# EAGLE design Trless Modular (EAGLE 9.3.2)
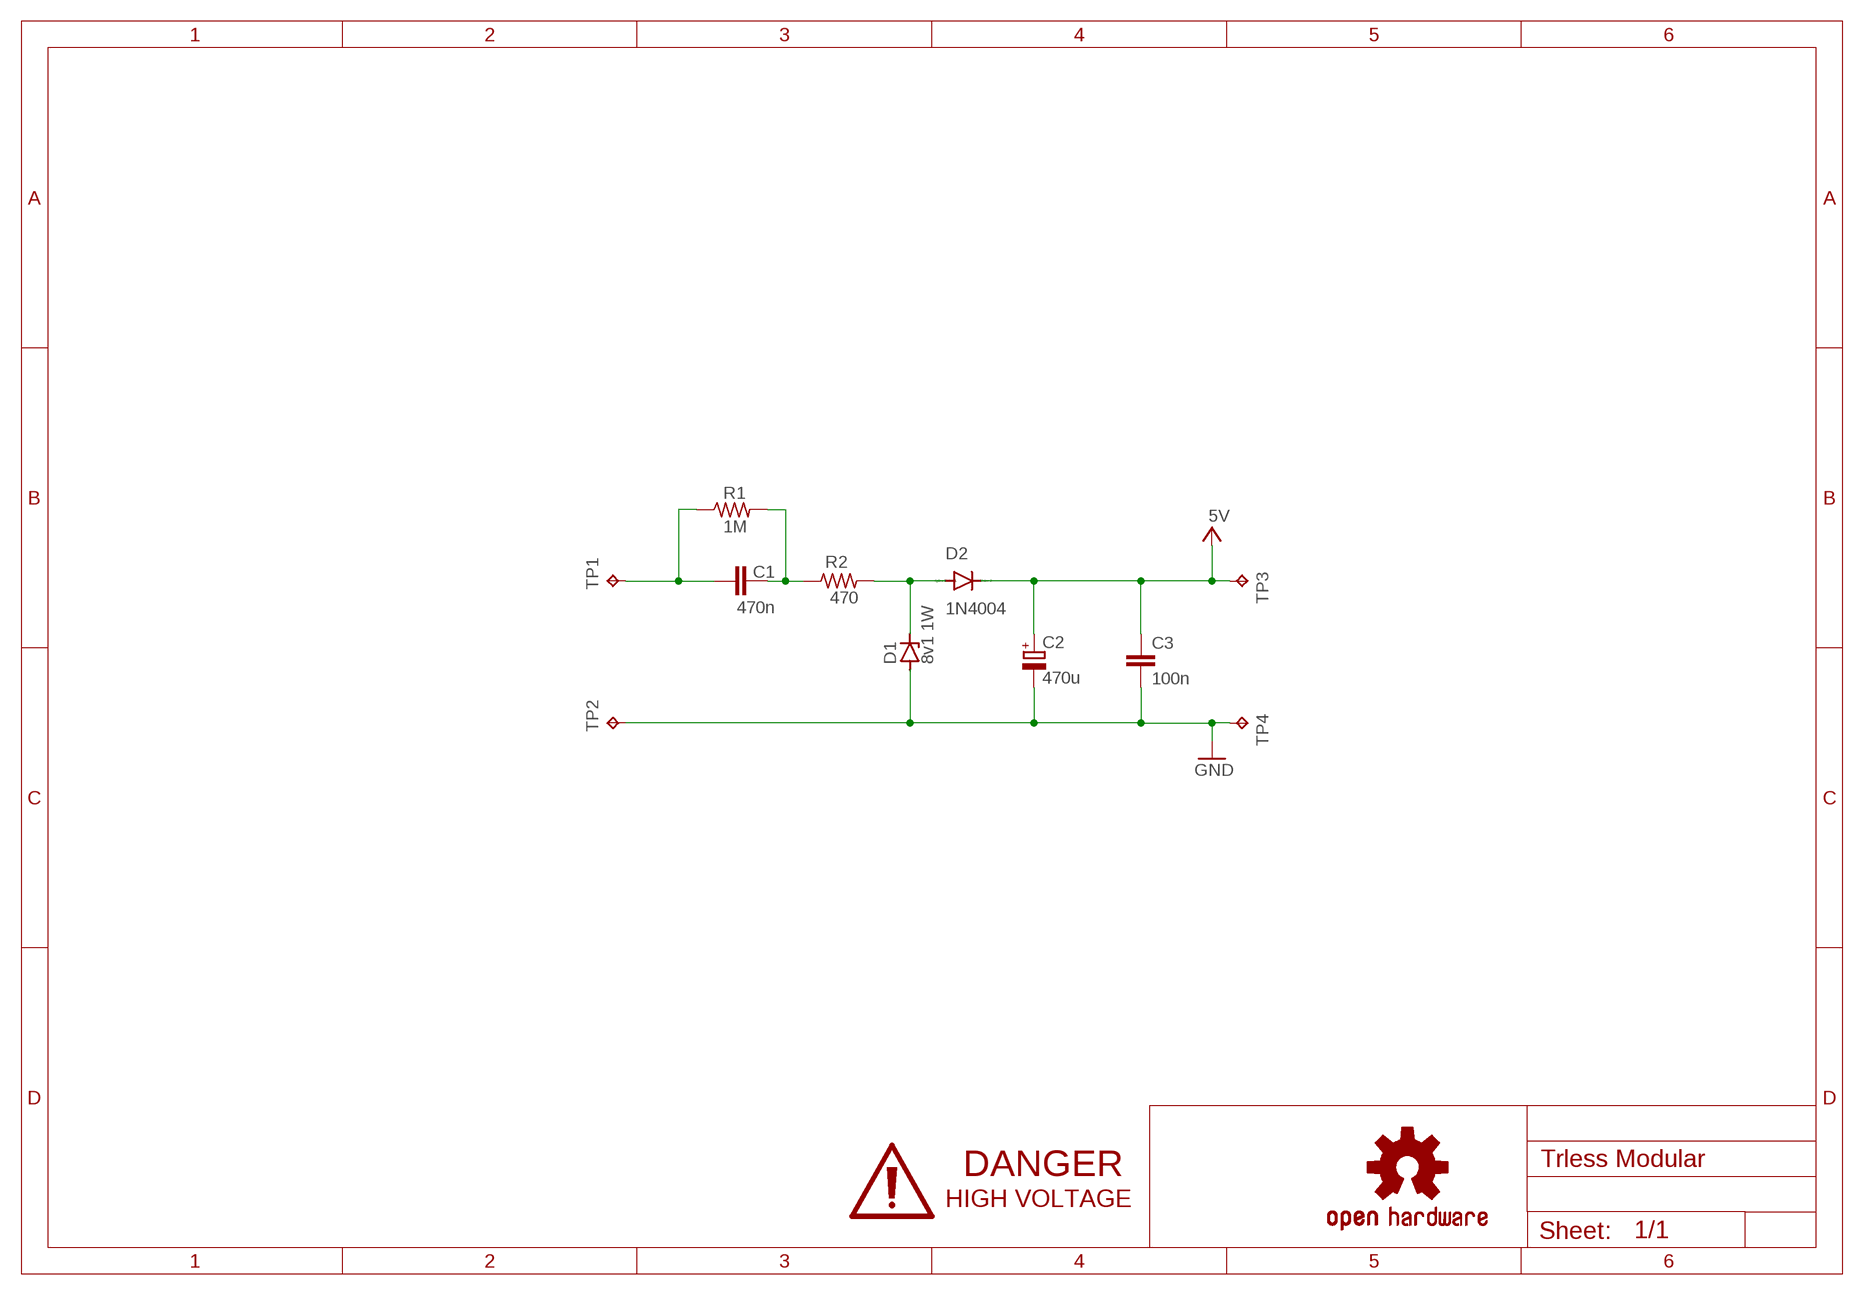
[diagram p0: schematic, sheet 1]

## Parts
C1  470n  C-EU150-054X183  [C150-054X183]
C2  470u  CPOL-EUE3.5-8  [E3,5-8]
C3  100n  C-EU050-024X044  [C050-024X044]
D1  8v1 1W  ZENER-DIODEDO35Z10  [DO35Z10]
D2  1N4004  [DO41-10]
L2  OSHW-LOGOS  [OSHW-LOGO-S]
R1  1M  R-US_0207/10  [0207/10]
R2  470  R-US_0207/10  [0207/10]
TP1  TPPAD1-17  [P1-17]
TP2  TPPAD1-17  [P1-17]
TP3  TPPAD1-17  [P1-17]
TP4  TPPAD1-17  [P1-17]

## Nets
+3V3: C2.+ C3.1 D2.C TP3.TP ; supply symbol labelled 5V
GND: C2.- C3.2 D1.A TP2.TP TP4.TP
LINE: C1.1 R1.1 TP1.TP
N$6: C1.2 R1.2 R2.1
N$7: D1.C D2.A R2.2

## Library data of the parts
C1 C3 = rcl:C-EU: CAPACITOR, European symbol; SPICEPREFIX: C
C2 = rcl:CPOL-EU: POLARIZED CAPACITOR, European symbol; SPICEPREFIX: C
D1 = diode:ZENER-DIODE: Z-Diode
D2 = diode:1N4004: DIODE general purpose rectifier, 1 A
L2 = SparkFun-Aesthetics:OSHW-LOGO: Open Source Hardware Logo This logo indicates the piece of hardware it is found on incorporates a OSHW license and/or adheres to the definition of open source hardware found here: http://freedomdefined.org/OSHW
R1 R2 = rcl:R-US_: RESISTOR, American symbol; SPICEPREFIX: R
TP1-TP4 = testpad:TP: Test pad

## Board
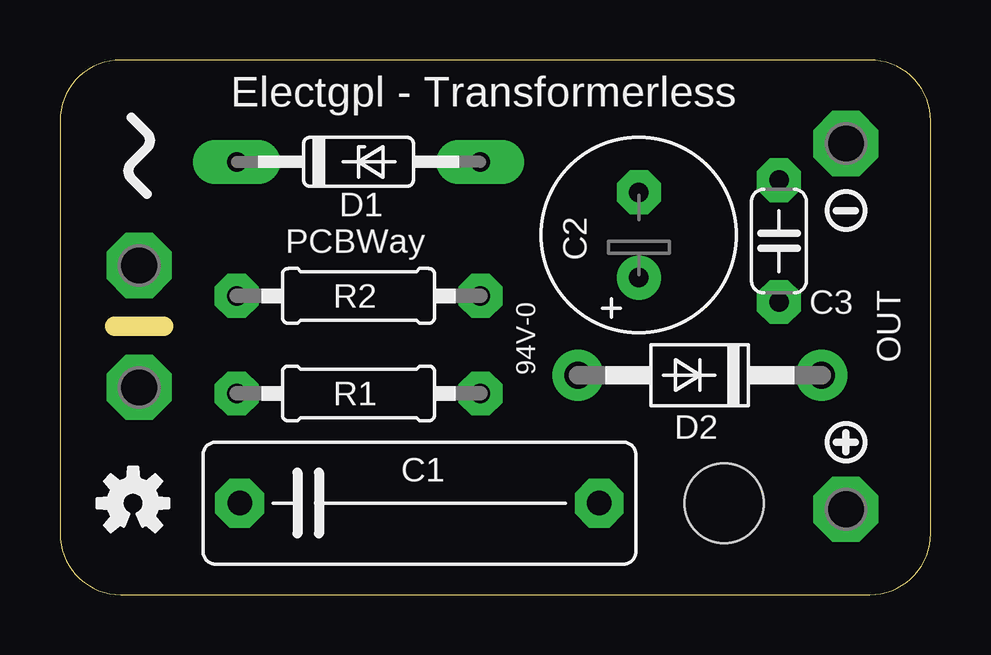
[diagram p1: board, top side]
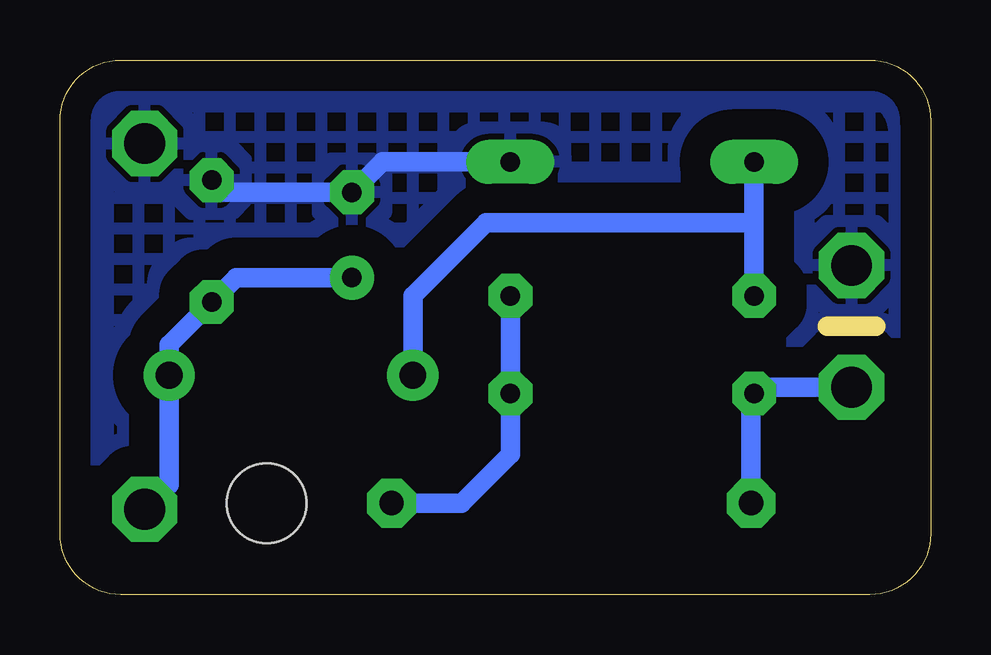
[diagram p2: board, bottom side, seen from below]

Size 36.3 x 22.28 mm. Coordinates in mm from the lower left corner, seen from the top.
Outline: 36.3,2.54 36.3,19.74 arc90 33.76,22.28 2.54,22.28 arc90 0,19.74 0,2.54 arc90 2.54,0 33.76,0 arc90 36.3,2.54
Copper layers (1*16): Top 0.035mm / dielectric 1.5mm / Bottom 0.035mm
Design rules "default *": minimum track width 6mil, minimum drill 0.35mm, track to track 6mil, track to pad 6mil, pad to pad 6mil, via to via 6mil, smd to smd 6mil, copper to edge 40mil, drill to drill 6mil, minimum pad ring 20mil, minimum via ring 8mil, stop-mask expansion 4mil, vias tented up to drill 50mil, thermal gap 10mil
Holes 3.3 mm at 27.69,3.81
Milling: 1 lines

### Footprints (pad centres in the part's own frame; a part is rotated, then mirrored left to right if it is on the bottom)
C150-054X183 = drill 1.016 octagon: 1 -7.493,0; 2 7.493,0
E3,5-8 = drill 0.813 pad 1.6: + -1.778,0 | drill 0.813 pad 1.6 octagon: - 1.778,0
C050-024X044 = drill 0.813 octagon: 1 -2.54,0; 2 2.54,0
DO35Z10 = drill 0.813 long: A 5.08,0; C -5.08,0
DO41-10 = drill 1.118: A 5.08,0; C -5.08,0
0207/10 = drill 0.813 octagon: 1 -5.08,0; 2 5.08,0
P1-17 = drill 1.702 pad 2.54 octagon: TP 0,0

### Placement (x,y rotation side)
C1  14.99,3.81 0 top
C2  24.13,14.99 90 top
C3  29.97,14.73 90 top
D1  12.45,18.03 0 top
D2  26.67,9.14 180 top
L2  3.05,3.81 0 top
R1  12.45,8.38 0 top
R2  12.45,12.45 180 top
TP1  3.3,8.64 0 top
TP2  3.3,13.72 0 top
TP3  32.77,3.56 180 top
TP4  32.77,18.8 0 top
U$1  [ICON_AC]  3.3,18.29 90 top
U$2  [ICON_MINUS]  32.77,16 0 top
U$3  [ICON_PLUS]  32.77,6.35 0 top

### Tracks (layer width: path | path; a pad name or v marks a point on that pad's centre or on a via)
+3V3
  Bottom 0.813: C2.+ 28.96,13.21 C3.1 31.75,10.41 D2.C 31.75,4.57 TP3.TP
GND
  Bottom 0.813: D1.A 22.86,18.03 C2.- 29.46,16.76
  pour Bottom (isolate 1.27, hatched): -1.27,23.37 37.59,23.37 37.59,-0.25 -1.27,-0.25
LINE
  Bottom 0.813: C1.1 7.49,8.26 | 7.49,8.26 R1.1 7.07,8.68 | TP1.TP 7.49,8.64 7.49,8.26
N$6
  Bottom 0.813: R2.1 R1.2 | R1.2 17.91,8.38 | R1.2 17.53,5.84 19.56,3.81 C1.2
N$7
  Bottom 0.813: D1.C 7.37,15.49 | 7.37,15.49 R2.2 | 7.37,15.49 18.54,15.49 21.59,12.45 D2.A

### Text on the board
tNames: Electgpl - Transformerless | PCBWay | OUT | 94V-0